# EAGLE design Atmega162_prj_board (EAGLE 7.1.0)
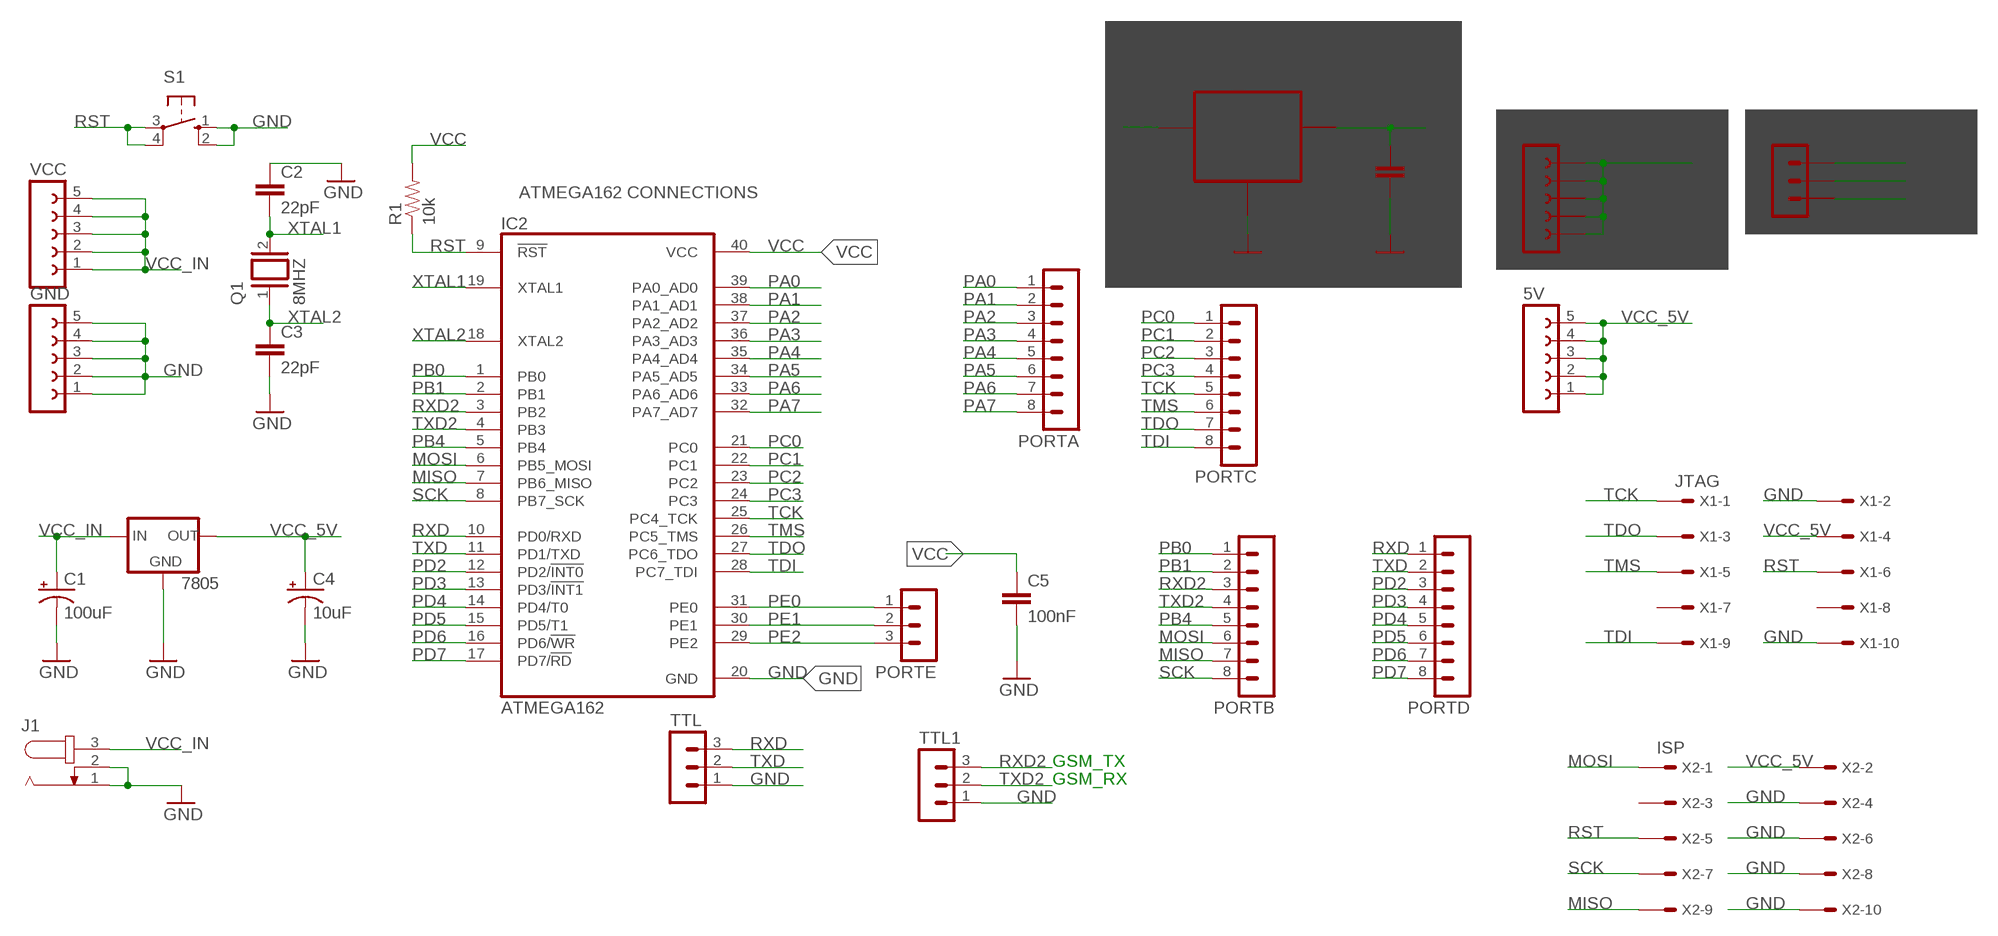
[diagram p0: schematic, sheet 1]

## Parts
3.3V  FE05-1  [FE05-1]
5V  FE05-1  [FE05-1]
7805  78XXS  [78XXS]
C1  100uF  CAP_POLPTH1  [CPOL-RADIAL-100UF-25V]
C2  22pF  CAPEZ  [CAP-PTH-SMALLEZ]
C3  22pF  CAPEZ  [CAP-PTH-SMALLEZ]
C4  10uF  CAP_POLPTH2  [CPOL-RADIAL-10UF-25V]
C5  100nF  CAP0805  [0805]
C8  10uF  1.0UF-25V-+80/-20(0805)  [0805]
GND  FE05-1  [FE05-1]
IC2  ATMEGA162  AT89S51-24P  [DIL40]
J1  JACK-PLUG0  [SPC4077]
PORTA  MA08-1  [MA08-1]
PORTB  MA08-1  [MA08-1]
PORTC  MA08-1  [MA08-1]
PORTD  MA08-1  [MA08-1]
PORTE  MA03-1  [MA03-1]
Q1  8MHZ  XTAL/S  [QS]
R1  10k  10KOHM-1/4W-1%(PTH)HORIZ  [AXIAL-0.3]
REG_3.3V  REG1117  [SOT223]
S1  10-XX  [B3F-10XX]
TTL  MA03-1  [MA03-1]
TTL1  MA03-1  [MA03-1]
VCC  FE05-1  [FE05-1]
VCC_SEL  MA03-1  [MA03-1]
X1  JTAG  057-010-1  [057-010-1]
X2  ISP  057-010-1  [057-010-1]

## Nets
GND: 7805.GND C1.2(-) C2.1 C3.2 C4.2(-) C5.2 C8.2 GND.1 GND.2 GND.3 GND.4 GND.5 IC2.20(GND) J1.1 J1.2 REG_3.3V.1(GND) S1.1(S) S1.2(S1) TTL1.1 TTL.1 X1.2 X1.10 X2.4 X2.6 X2.8 X2.10
MISO: IC2.7(PB6_MISO) PORTB.7 X2.9
MOSI: IC2.6(PB5_MOSI) PORTB.6 X2.1
PA0: IC2.39(PA0_AD0) PORTA.1
PA1: IC2.38(PA1_AD1) PORTA.2
PA2: IC2.37(PA2_AD2) PORTA.3
PA3: IC2.36(PA3_AD3) PORTA.4
PA4: IC2.35(PA4_AD4) PORTA.5
PA5: IC2.34(PA5_AD5) PORTA.6
PA6: IC2.33(PA6_AD6) PORTA.7
PA7: IC2.32(PA7_AD7) PORTA.8
PB0: IC2.1(PB0) PORTB.1
PB1: IC2.2(PB1) PORTB.2
PB4: IC2.5(PB4) PORTB.5
PC0: IC2.21(PC0) PORTC.1
PC1: IC2.22(PC1) PORTC.2
PC2: IC2.23(PC2) PORTC.3
PC3: IC2.24(PC3) PORTC.4
PD2: IC2.12(PD2/!INT0) PORTD.3
PD3: IC2.13(PD3/!INT1) PORTD.4
PD4: IC2.14(PD4/T0) PORTD.5
PD5: IC2.15(PD5/T1) PORTD.6
PD6: IC2.16(PD6/!WR) PORTD.7
PD7: IC2.17(PD7/!RD) PORTD.8
PE0: IC2.31(PE0) PORTE.1
PE1: IC2.30(PE1) PORTE.2
PE2: IC2.29(PE2) PORTE.3
RST: IC2.9(!RST) R1.P$1 S1.3(P) S1.4(P1) X1.6 X2.5
RXD: IC2.10(PD0/RXD) PORTD.1 TTL.3
RXD2: IC2.3(PB2) PORTB.3 TTL1.3
SCK: IC2.8(PB7_SCK) PORTB.8 X2.7
TCK: IC2.25(PC4_TCK) PORTC.5 X1.1
TDI: IC2.28(PC7_TDI) PORTC.8 X1.9
TDO: IC2.27(PC6_TDO) PORTC.7 X1.3
TMS: IC2.26(PC5_TMS) PORTC.6 X1.5
TXD: IC2.11(PD1/TXD) PORTD.2 TTL.2
TXD2: IC2.4(PB3) PORTB.4 TTL1.2
VCC: C5.1 IC2.40(VCC) R1.P$2 VCC_SEL.2
VCC_3.3V: 3.3V.1 3.3V.2 3.3V.3 3.3V.4 3.3V.5 C8.1 REG_3.3V.2(VOUT) VCC_SEL.1
VCC_5V: 5V.1 5V.2 5V.3 5V.4 5V.5 7805.OUT C4.1(+) REG_3.3V.3(VIN) VCC_SEL.3 X1.4 X2.2
VCC_IN: 7805.IN C1.1(+) J1.3 VCC.1 VCC.2 VCC.3 VCC.4 VCC.5
XTAL1: C2.2 IC2.19(XTAL1) Q1.2
XTAL2: C3.1 IC2.18(XTAL2) Q1.1
Unconnected: X1.7 X1.8 X2.3

## Notes on the sheet
- ATMEGA162 CONNECTIONS
- GSM_TX
- GSM_RX

## Library data of the parts
3.3V 5V GND VCC = con-lsta:FE05-1: FEMALE HEADER; OC_FARNELL: unknown; OC_NEWARK: unknown
7805 = v-reg:78XXS: VOLTAGE REGULATOR
C1 C4 = SparkFun-Capacitors:CAP_POL: Capacitor Polarized These are standard SMD and PTH capacitors. Normally 10uF, 47uF, and 100uF in electrolytic and tantalum varieties. Always verify the external diameter of the through hole cap, it varies with capacity, voltage, and manufacturer. The EIA devices should be standard.
C2 C3 C5 = SparkFun-Capacitors:CAP: Capacitor Standard 0603 ceramic capacitor, and 0.1" leaded capacitor.
C8 = SparkFun-Capacitors:1.0UF-25V-+80/-20(0805): CAP-11625; PROD_ID: CAP-11625; VALUE: 1.0uF
IC2 = atmel162_dip:AT89S51-*: 8-bit Microcontroller with 4K BytesIn-System Programmable Flash Source: http://www.atmel.com/dyn/resources/prod_documents/doc2487.pdf; MPN: AT89S51-24PU; OC_FARNELL: 1095739; OC_NEWARK: 96K6578
J1 = con-jack:JACK-PLUG: DC POWER JACK Power Jack, DC, Right Angle, Through Hole, Rated 5A at 16VDC, PC Terminals Distributor: Farnell (www.Farnell.de) Drawing: 84N1161.pdf / 84N1162.pdf Manufacturer: SPC Technology (www.spctechnology.com) Type: SPC4077 / SPC 4078; OC_FARNELL: unknown; OC_NEWARK: unknown
PORTA PORTB PORTC PORTD = con-lstb:MA08-1: PIN HEADER; OC_FARNELL: unknown; OC_NEWARK: unknown
PORTE TTL TTL1 VCC_SEL = con-lstb:MA03-1: PIN HEADER; OC_FARNELL: unknown; OC_NEWARK: unknown
Q1 = special:XTAL/S: CRYSTAL
R1 = SparkFun-Resistors:10KOHM-1/4W-1%(PTH): RES-12183; PROD_ID: RES-12183
REG_3.3V = burr-brown:REG1117: 800mA and 1A Low Dropout (LDO) Positive Regulator 1.8V, 2.5V, 2.85V, 3.3V, 5V, and Adj; MPN: REG1117; OC_FARNELL: 1097566; OC_NEWARK: 14P6981
S1 = switch-omron:10-XX: OMRON SWITCH; MPN: B3F-1000; OC_FARNELL: 176432; OC_NEWARK: 36M3542
X1 X2 = con-panduit:057-010-: CONNECTOR 10-pin series 057 contact pc board low profile headers; OC_FARNELL: unknown; OC_NEWARK: unknown

## Board
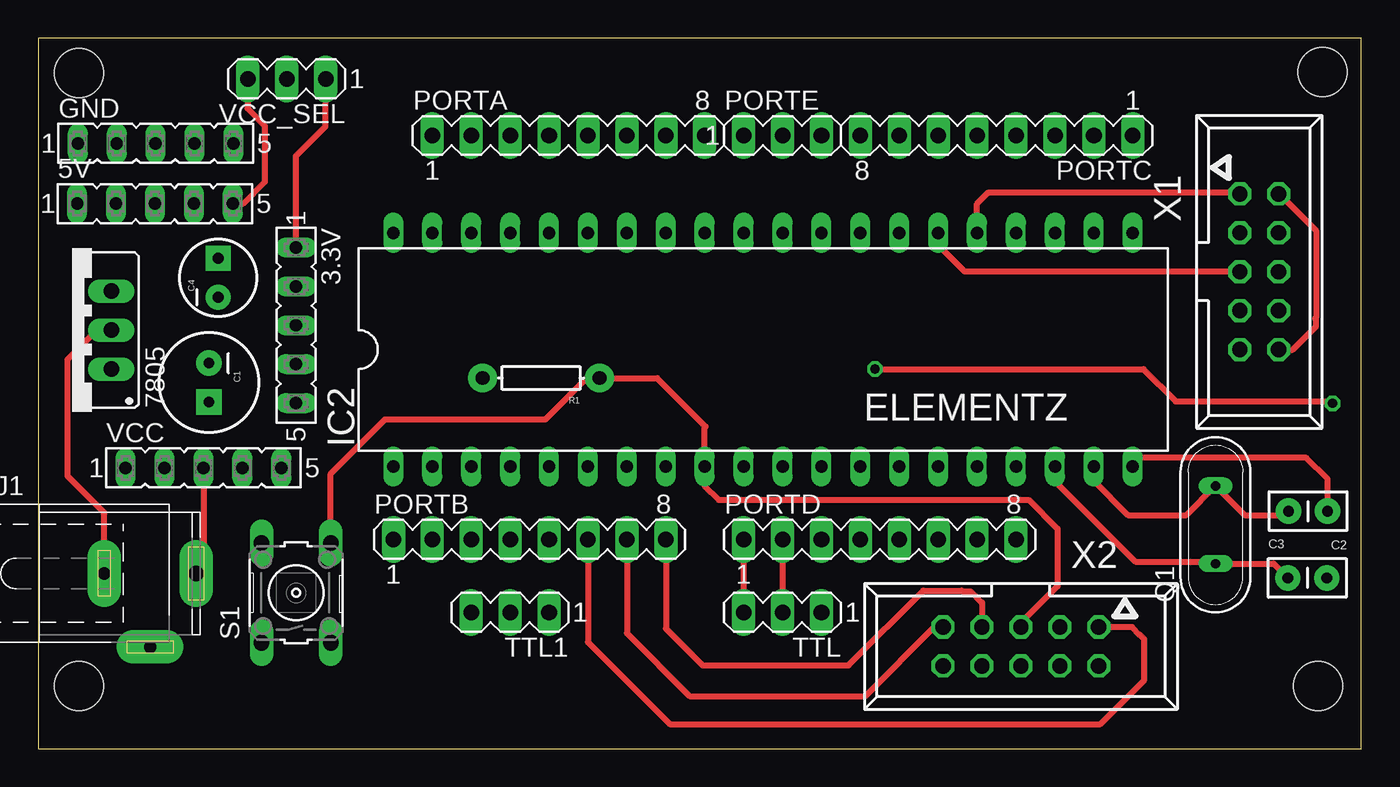
[diagram p1: board, top side]
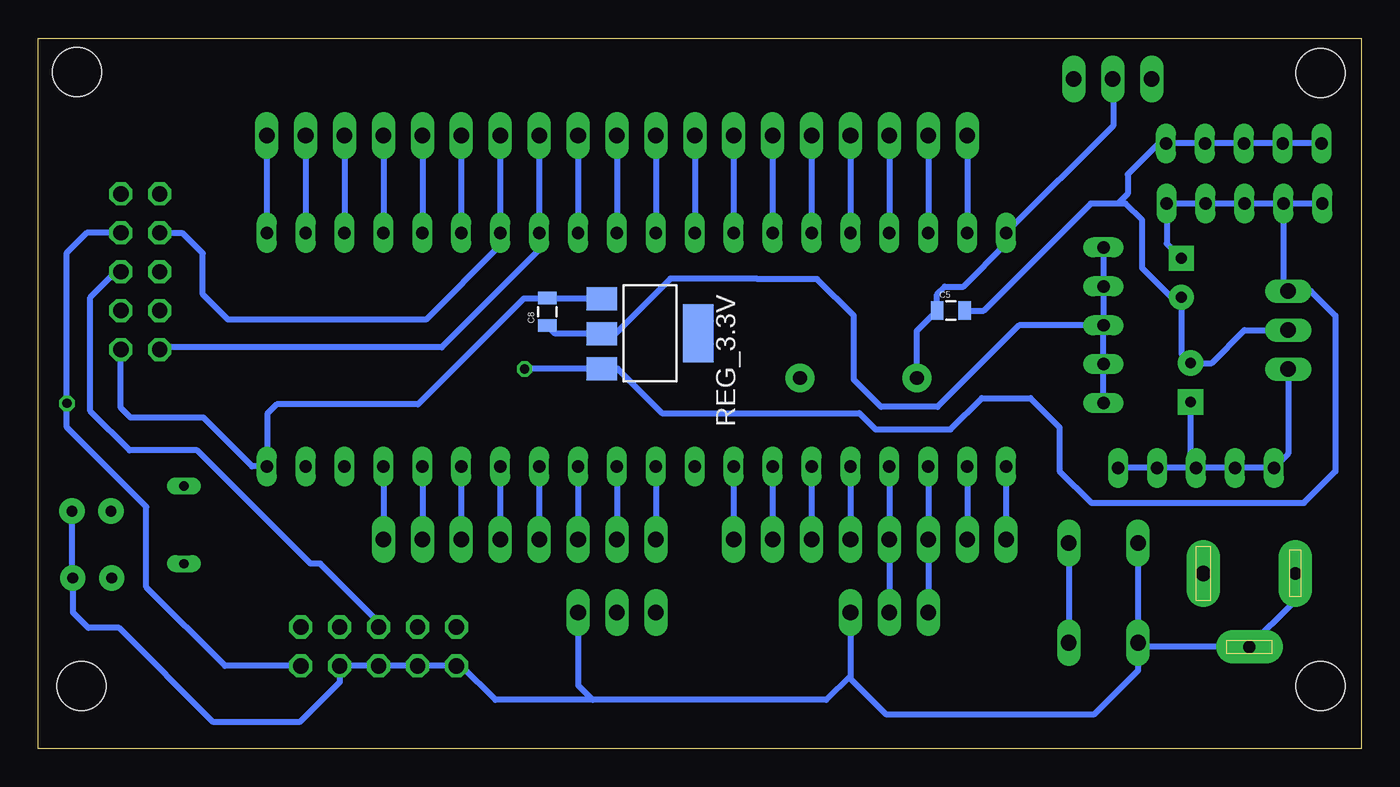
[diagram p2: board, bottom side, seen from below]

Size 86.35 x 46.34 mm. Coordinates in mm from the lower left corner, seen from the top.
Outline: 0,0 86.35,0 86.35,46.34 0,46.34 0,0
Copper layers (1*16): Top 0.035mm / dielectric 1.5mm / Bottom 0.035mm
Design rules: minimum track width 16mil, minimum drill 24mil, track to track 16mil, track to pad 24mil, pad to pad 16mil, via to via 16mil, smd to smd 16mil, copper to edge 40mil, drill to drill 8mil, minimum pad ring 10mil, minimum via ring 8mil, stop-mask expansion 4mil, vias tented up to drill 0mil, thermal gap 10mil
Holes 3.2 mm at 83.53,4.08 83.82,44.16 2.67,44.08 2.67,4.08

### Footprints (pad centres in the part's own frame; a part is rotated, then mirrored left to right if it is on the bottom)
FE05-1 = drill 0.813 long: 1 -5.08,0; 2 -2.54,0; 3 0,0; 4 2.54,0; 5 5.08,0
78XXS = drill 1.016 long: GND 0,-2.54; IN -2.54,-2.54; OUT 2.54,-2.54
CPOL-RADIAL-100UF-25V = drill 0.7 pad 1.651 square: 1 1.27,0 | drill 0.7 pad 1.651: 2 -1.27,0
CAP-PTH-SMALLEZ = drill 0.7 pad 1.651: 1 0,0; 2 2.54,0
CPOL-RADIAL-10UF-25V = drill 0.7 pad 1.651 square: 1 1.27,0 | drill 0.7 pad 1.651: 2 -1.27,0
0805 = smd 0.8 x 1.2: 1 -0.9,0; 2 0.9,0
DIL40 = drill 0.813 long: 1 -24.13,-7.62; 2 -21.59,-7.62; 3 -19.05,-7.62; 4 -16.51,-7.62; 5 -13.97,-7.62; 6 -11.43,-7.62; 7 -8.89,-7.62; 8 -6.35,-7.62; 9 -3.81,-7.62; 10 -1.27,-7.62; 11 1.27,-7.62; 12 3.81,-7.62; 13 6.35,-7.62; 14 8.89,-7.62; 15 11.43,-7.62; 16 13.97,-7.62; 17 16.51,-7.62; 18 19.05,-7.62; 19 21.59,-7.62; 20 24.13,-7.62; 21 24.13,7.62; 22 21.59,7.62; 23 19.05,7.62; 24 16.51,7.62; 25 13.97,7.62; 26 11.43,7.62; 27 8.89,7.62; 28 6.35,7.62; 29 3.81,7.62; 30 1.27,7.62; 31 -1.27,7.62; 32 -3.81,7.62; 33 -6.35,7.62; 34 -8.89,7.62; 35 -11.43,7.62; 36 -13.97,7.62; 37 -16.51,7.62; 38 -19.05,7.62; 39 -21.59,7.62; 40 -24.13,7.62
SPC4077 = drill 0.8 pad 2.184 long: 1 -3,0; 2 0,-4.8 | drill 1 pad 2.184 long: 3 3,0
MA08-1 = drill 1.016 long: 1 -8.89,0; 2 -6.35,0; 3 -3.81,0; 4 -1.27,0; 5 1.27,0; 6 3.81,0; 7 6.35,0; 8 8.89,0
MA03-1 = drill 1.016 long: 1 -2.54,0; 2 0,0; 3 2.54,0
QS = drill 0.61 long: 1 -2.54,0; 2 2.54,0
AXIAL-0.3 = drill 0.9 pad 1.88: P$1 -3.81,0; P$2 3.81,0
SOT223 = smd 1.499 x 2.007: 1 -2.261,-3.15; 2 0.025,-3.15; 3 2.311,-3.15 | smd 3.81 x 2.007: 4 0,3.15
B3F-10XX = drill 1.016 long: 1 -3.251,2.261; 2 3.251,2.261; 3 -3.251,-2.261; 4 3.251,-2.261
057-010-1 = drill 1 octagon: 1 -5.08,-1.27; 2 -5.08,1.27; 3 -2.54,-1.27; 4 -2.54,1.27; 5 0,-1.27; 6 0,1.27; 7 2.54,-1.27; 8 2.54,1.27; 9 5.08,-1.27; 10 5.08,1.27

### Placement (x,y rotation side)
3.3V  16.83,27.62 270 top
5V  7.62,35.56 0 top
7805  2.22,27.3 90 top
C1  11.14,23.89 270 top
C2  84.15,15.49 180 top
C3  81.56,11.14 0 top
C4  11.73,30.72 90 top
C5  26.78,28.57 0 bottom
C8  53.14,28.5 90 bottom
GND  7.66,39.48 0 top
IC2  47.31,26.04 0 top
J1  7.3,11.43 0 top
PORTA  34.61,40.01 0 top
PORTB  32.07,13.65 0 top
PORTC  62.55,40.01 180 top
PORTD  54.93,13.65 0 top
PORTE  48.58,40.01 0 top
Q1  76.83,14.61 90 top
R1  32.82,24.18 180 top
REG_3.3V  46.42,27.1 270 bottom
S1  16.83,10.16 90 top
TTL  48.58,8.89 180 top
TTL1  30.8,8.89 180 top
VCC  10.78,18.31 0 top
VCC_SEL  16.22,43.7 180 top
X1  79.69,31.11 270 top
X2  64.14,6.67 180 top

### Tracks (layer width: path | path; a pad name or v marks a point on that pad's centre or on a via)
GND
  Top 0.406: X1.2 81,36.2 83.41,33.78 83.41,28.14 83.34,28.07 83.41,27.99 83.41,27.56 81.89,26.04 X1.10 | C2.1 84.15,17.6 82.78,18.97 72,18.97 IC2.20 | J1.1 4.3,15.38 1.91,17.78 1.91,25.4 3.81,27.3 7805.GND
  Bottom 0.406: C2.1 84.15,11.19 C3.2 84.1,8.89 83.08,7.87 81.08,7.87 74.93,1.73 69.29,1.73 66.67,4.34 X2.4 X2.6 X2.8 X2.10 58.74,5.4 56.52,3.17 50.16,3.17 | 7805.GND 7.62,27.3 9.77,25.16 C1.2 11.73,25.76 C4.2 12.41,29.45 14.3,31.34 14.3,34.49 15.37,35.56 15.88,35.56 | GND.1 GND.2 GND.3 GND.4 GND.5 13.22,39.48 15.24,37.47 15.24,36.2 15.88,35.56 | S1.2 S1.1 | C8.2 53.1,29.36 REG_3.3V.1 54.66,29.36 61.57,22.45 70.79,22.45 71.4,21.84 71.4,18.45 IC2.20 72.39,18.41 75.56,21.59 80.33,21.59 80.96,22.23 X1.10 | J1.1 4.45,11.29 4.45,9.53 7.3,6.67 J1.2 14.29,6.63 S1.1 | 15.88,35.56 17.65,35.56 24.64,28.57 C5.2 | S1.1 14.57,5.09 17.45,2.21 30.99,2.21 33.3,4.52 33.3,8.85 TTL1.1 33.34,4.76 34.92,3.17 50.16,3.17 | TTL.1 51.12,4.13 50.16,3.17
MISO
  Top 0.406: PORTB.7 38.42,7.53 42.52,3.43 53.98,3.43 58.48,7.94 X2.9
  Bottom 0.406: IC2.7 PORTB.7
MOSI
  Top 0.406: PORTB.6 35.88,6.95 41.22,1.6 69.32,1.6 72.19,4.47 72.19,7.14 72.01,7.32 71.88,7.44 71.39,7.94 X2.1
  Bottom 0.406: IC2.6 PORTB.6
PA0
  Bottom 0.406: PORTA.1 IC2.39
PA1
  Bottom 0.406: PORTA.2 IC2.38
PA2
  Bottom 0.406: PORTA.3 IC2.37
PA3
  Bottom 0.406: PORTA.4 IC2.36
PA4
  Bottom 0.406: PORTA.5 IC2.35
PA5
  Bottom 0.406: PORTA.6 IC2.34
PA6
  Bottom 0.406: PORTA.7 IC2.33
PA7
  Bottom 0.406: PORTA.8 IC2.32
PB0
  Bottom 0.406: IC2.1 PORTB.1
PB1
  Bottom 0.406: IC2.2 PORTB.2
PB4
  Bottom 0.406: IC2.5 PORTB.5
PC0
  Bottom 0.406: PORTC.1 IC2.21
PC1
  Bottom 0.406: PORTC.2 IC2.22
PC2
  Bottom 0.406: PORTC.3 IC2.23
PC3
  Bottom 0.406: PORTC.4 IC2.24
PD2
  Bottom 0.406: IC2.12 PORTD.3
PD3
  Bottom 0.406: IC2.13 PORTD.4
PD4
  Bottom 0.406: IC2.14 PORTD.5
PD5
  Bottom 0.406: IC2.15 PORTD.6
PD6
  Bottom 0.406: IC2.16 PORTD.7
PD7
  Bottom 0.406: IC2.17 PORTD.8
PE0
  Bottom 0.406: PORTE.1 IC2.31
PE1
  Bottom 0.406: PORTE.2 IC2.30
PE2
  Bottom 0.406: PORTE.3 IC2.29
RST
  Top 0.406: X2.5 64.14,8.2 66.52,10.59 66.52,14.35 64.64,16.23 44.4,16.23 43.5,17.13 IC2.9 43.5,20.94 43.56,21.01 40.39,24.18 R1.P$1 35.79,24.18 33.1,21.49 22.63,21.49 19.09,17.95 S1.4
  Bottom 0.406: S1.4 S1.3 | X2.5 64.14,8.26 67.94,12.06 68.58,12.06 75.97,19.46 80.39,19.46 82.96,22.02 82.96,29.44 81.28,31.11 X1.6
RXD
  Top 0.406: PORTD.1 TTL.3
  Bottom 0.406: IC2.10 PORTD.1
RXD2
  Bottom 0.406: IC2.3 PORTB.3 TTL1.3
SCK
  Top 0.406: PORTB.8 40.96,7.84 43.36,5.44 52.88,5.44 57.76,10.31 60.27,10.31 60.33,10.26 60.86,10.26 61.59,9.53 X2.7
  Bottom 0.406: IC2.8 PORTB.8
TCK
  Top 0.406: IC2.25 61.28,35.55 62.03,36.3 78.32,36.3 X1.1
  Bottom 0.406: PORTC.5 IC2.25
TDI
  Bottom 0.406: PORTC.8 IC2.28 53.66,32.55 60.02,26.19 78.27,26.19 X1.9
TDO
  Bottom 0.406: PORTC.7 IC2.27 56.2,32.83 61.04,27.99 73.97,27.99 75.62,29.64 75.62,32.31 76.96,33.66 X1.3
TMS
  Top 0.406: IC2.26 58.74,32.85 60.45,31.14 78.4,31.14 X1.5
  Bottom 0.406: PORTC.6 IC2.26
TXD
  Top 0.406: PORTD.2 TTL.2
  Bottom 0.406: IC2.11 PORTD.2
TXD2
  Bottom 0.406: IC2.4 PORTB.4 TTL1.2
VCC
  Bottom 0.406: R1.P$2 29.01,27.25 C5.1 27.68,29.64 27.18,30.15 25.96,30.15 23.18,32.93 IC2.40 16.19,40.64 VCC_SEL.2
VCC_3.3V
  Top 0.406: 3.3V.1 16.83,38.67 18.73,40.58 VCC_SEL.1
  Bottom 0.406: 3.3V.1 3.3V.2 3.3V.3 | 3.3V.3 3.3V.4 3.3V.5 | C8.1 52.61,27.08 REG_3.3V.2 48.67,27.08 45.09,30.66 39.45,30.66 39.42,30.63 35.51,30.63 33.12,28.25 33.12,24.08 31.34,22.3 27.66,22.3 22.34,27.62 3.3V.3
VCC_5V  (via drill 0.6)
  Top 0.406: VCC_SEL.3 13.65,41.77 14.78,40.64 14.78,36.98 13.36,35.56 5V.5 | v54.61,24.77 72.14,24.77 74.24,22.66 84.35,22.66 v84.48,22.53
  Bottom 0.406: 5V.2 5.08,30.16 7805.OUT 3.28,29.84 1.68,28.25 1.68,18.09 3.73,16.03 17.6,16.03 19.68,18.11 19.68,20.95 21.59,22.86 24.77,22.86 26.8,20.83 31.7,20.83 32.77,21.89 45.64,21.89 48.54,24.79 REG_3.3V.3 54.59,24.79 v54.61,24.77 | 5V.1 5V.2 | 5V.2 5V.3 5V.4 5V.5 12.7,32.96 C4.1 | X2.2 74.16,5.4 79.3,10.54 79.3,15.77 84.48,20.95 84.48,22.23 v84.48,22.53 84.48,32.36 83.19,33.66 X1.4
VCC_IN
  Top 0.406: VCC.3 10.78,11.91 J1.3
  Bottom 0.406: VCC.3 VCC.2 VCC.1 4.76,19.25 7805.IN | VCC.3 VCC.4 VCC.5 | C1.1 11.14,18.67 VCC.3
XTAL1
  Top 0.406: IC2.19 68.9,17.46 71.12,15.24 74.93,15.24 Q1.2 78.74,15.24 81.36,15.24 C2.2
XTAL2
  Top 0.406: IC2.18 66.36,17.44 71.6,12.19 76.71,12.19 Q1.1 80.63,12.06 C3.1

### Text on the board
tPlace: ELEMENTZ